# EAGLE design Guri_AVR.old (EAGLE 7.3.0)
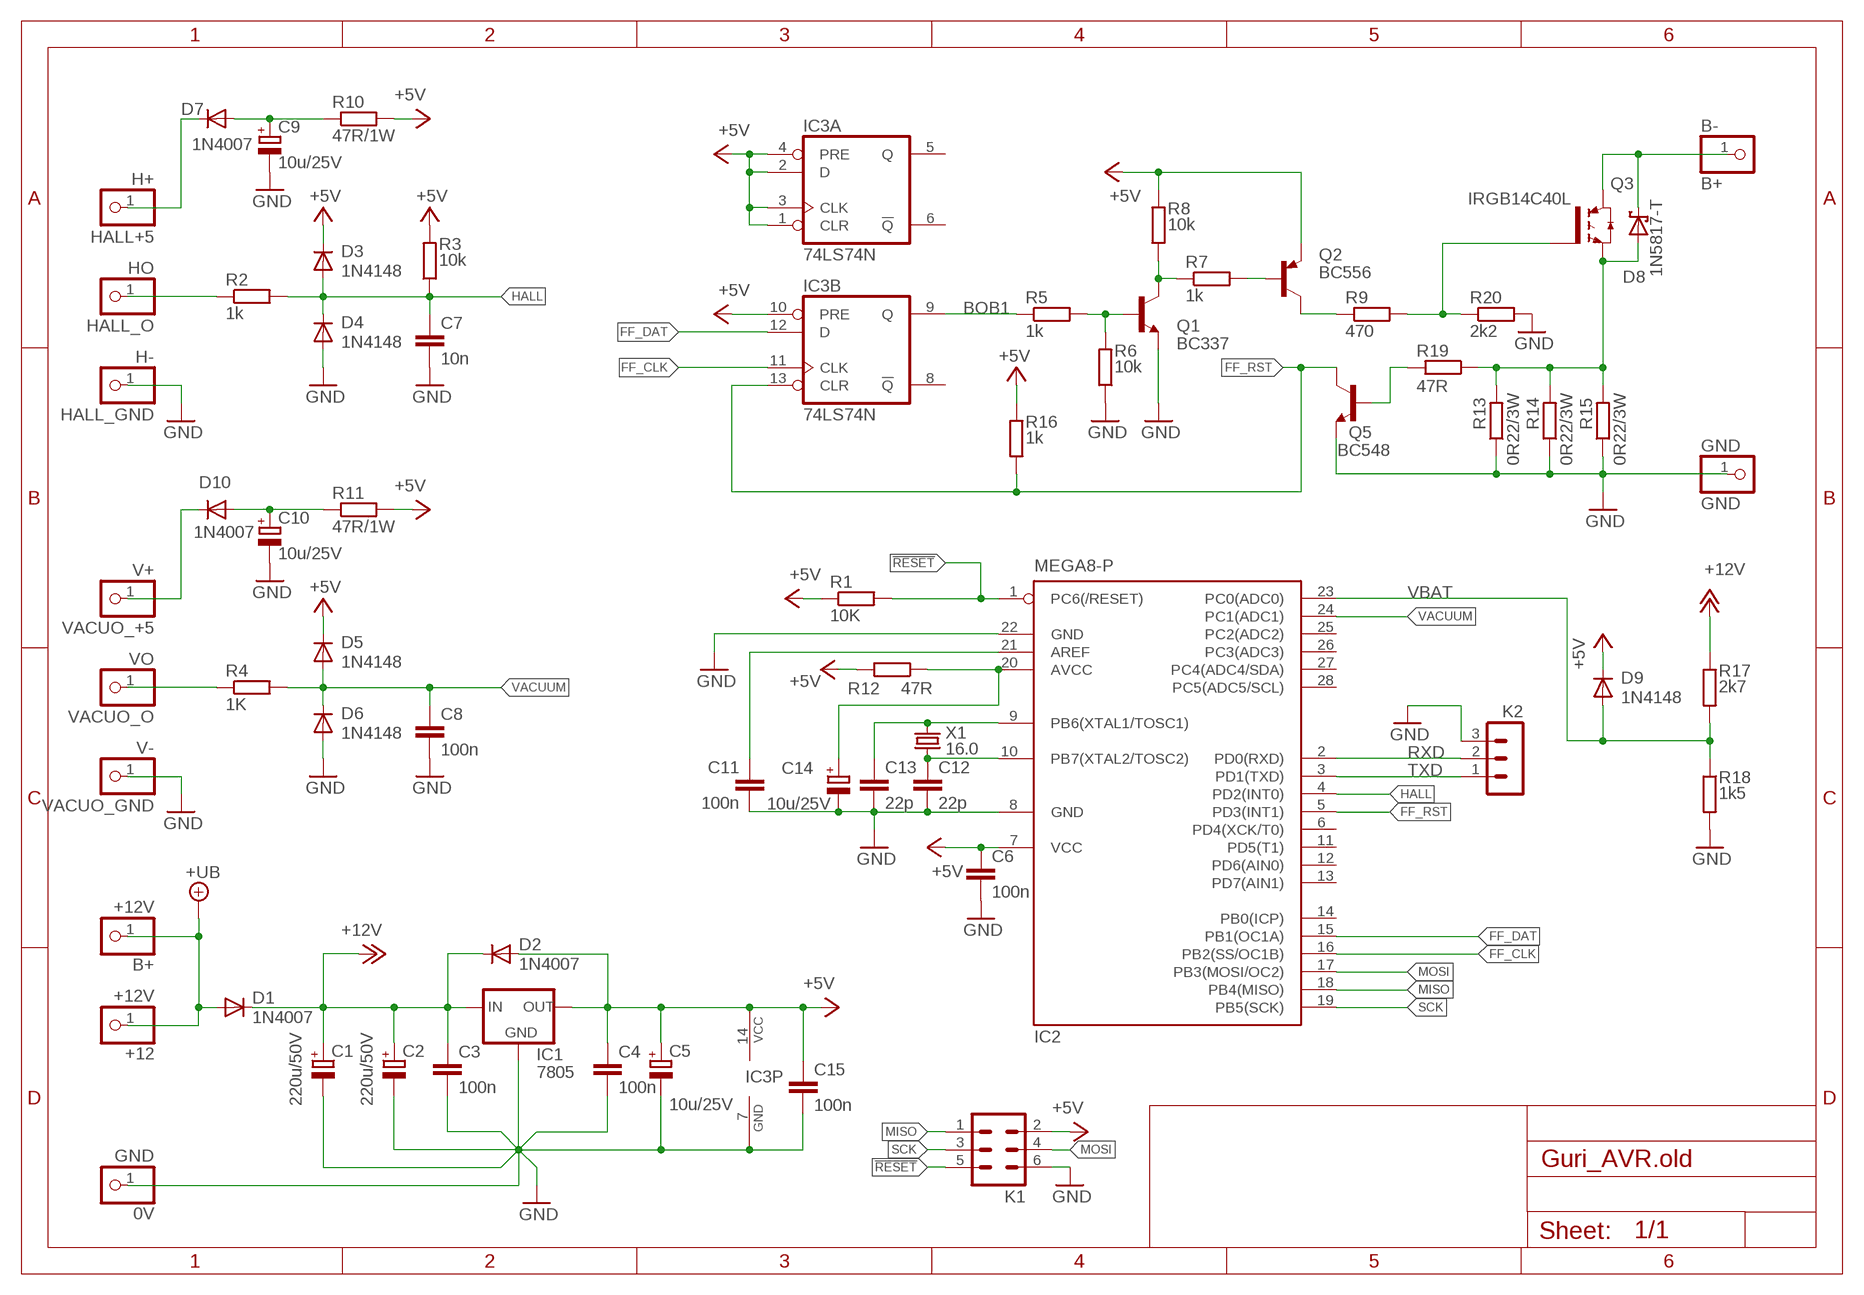
[diagram p0: schematic, sheet 1]

## Parts
0V  GND  PINHD-1X1  [1X01]
+12  +12V  PINHD-1X1  [1X01]
B+  +12V  PINHD-1X1  [1X01]
B-  B+  PINHD-1X1  [1X01]
C1  220u/50V  CPOL-EUE5-10.5  [E5-10,5]
C2  220u/50V  CPOL-EUE5-10.5  [E5-10,5]
C3  100n  C-EU050-025X075  [C050-025X075]
C4  100n  C-EU050-025X075  [C050-025X075]
C5  10u/25V  CPOL-EUE2-5  [E2-5]
C6  100n  C-EU050-025X075  [C050-025X075]
C7  10n  C-EU050-025X075  [C050-025X075]
C8  100n  C-EU050-025X075  [C050-025X075]
C9  10u/25V  CPOL-EUE2-5  [E2-5]
C10  10u/25V  CPOL-EUE2-5  [E2-5]
C11  100n  C-EU050-025X075  [C050-025X075]
C12  22p  C-EU050-024X044  [C050-024X044]
C13  22p  C-EU050-024X044  [C050-024X044]
C14  10u/25V  CPOL-EUE2-5  [E2-5]
C15  100n  C-EU050-025X075  [C050-025X075]
D1  1N4007  DIODE-D-7.5  [D-7.5]
D2  1N4007  DIODE-D-7.5  [D-7.5]
D3  1N4148  1N4148DO35-7  [DO35-7]
D4  1N4148  1N4148DO35-7  [DO35-7]
D5  1N4148  1N4148DO35-7  [DO35-7]
D6  1N4148  1N4148DO35-7  [DO35-7]
D7  1N4007  DIODE-D-7.5  [D-7.5]
D8  1N5817-T  [DO41-7.6]
D9  1N4148  1N4148DO35-7  [DO35-7]
D10  1N4007  DIODE-D-7.5  [D-7.5]
GND  GND  PINHD-1X1  [1X01]
H+  HALL+5  PINHD-1X1  [1X01]
H-  HALL_GND  PINHD-1X1  [1X01]
HO  HALL_O  PINHD-1X1  [1X01]
IC1  7805  78XXS  [78XXS]
IC2  MEGA8-P  [DIL28-3]
IC3  74LS74N  [DIL14]
K1  ML6  [ML6]
K2  MA03-1  [MA03-1]
Q1  BC337  BC338  [TO92-EBC]
Q2  BC556  [TO92-EBC]
Q3  IRGB14C40L  IRG4BC15UD--L  [TO262-V]
Q5  BC548  BC338  [TO92-EBC]
R1  10K  R-EU_0207/7L  [0207/7L]
R2  1k  R-EU_0207/7L  [0207/7L]
R3  10k  R-EU_0207/7L  [0207/7L]
R4  1K  R-EU_0207/7L  [0207/7L]
R5  1k  R-EU_0207/7L  [0207/7L]
R6  10k  R-EU_0207/7L  [0207/7L]
R7  1k  R-EU_0207/7L  [0207/7L]
R8  10k  R-EU_0207/7L  [0207/7L]
R9  470  R-EU_0207/7L  [0207/7L]
R10  47R/1W  R-EU_0207/7L  [0207/7L]
R11  47R/1W  R-EU_0207/7L  [0207/7L]
R12  47R  R-EU_0207/7L  [0207/7L]
R13  0R22/3W  R-EU_0309/10  [0309/10]
R14  0R22/3W  R-EU_0309/10  [0309/10]
R15  0R22/3W  R-EU_0309/10  [0309/10]
R16  1k  R-EU_0207/7L  [0207/7L]
R17  2k7  R-EU_0207/7L  [0207/7L]
R18  1k5  R-EU_0207/7L  [0207/7L]
R19  47R  R-EU_0207/7L  [0207/7L]
R20  2k2  R-EU_0207/7L  [0207/7L]
V+  VACUO_+5  PINHD-1X1  [1X01]
V-  VACUO_GND  PINHD-1X1  [1X01]
VO  VACUO_O  PINHD-1X1  [1X01]
X1  16.0  CRYSTALHC49S  [HC49/S]

## Nets
!RESET: IC2.1(PC6(/RESET)) K1.5 R1.4
+5V: C4.1 C5.+ C6.1 C15.1 D2.A D3.C D5.C D9.C IC1.OUT IC2.7(VCC) IC3.1(A:CLR) IC3.2(A:D) IC3.3(A:CLK) IC3.4(A:PRE) IC3.10(B:PRE) IC3.14(P:VCC) K1.2 Q2.E R1.3 R3.4 R8.4 R10.4 R11.4 R12.4 R16.4
+12V: C1.+ C2.+ C3.1 D1.C D2.C IC1.IN R17.3
+UB: +12.1 B+.1 D1.A
AREF: C11.1 IC2.21(AREF)
AVCC: C14.+ IC2.20(AVCC) R12.3
BOB1: IC3.9(B:Q) R5.3
FF_CLK: IC2.16(PB2(SS/OC1B)) IC3.11(B:CLK)
FF_DAT: IC2.15(PB1(OC1A)) IC3.12(B:D)
FF_RST: IC2.5(PD3(INT1)) IC3.13(B:CLR) Q5.C R16.3
GND: 0V.1 C1.- C2.- C3.2 C4.2 C5.- C6.2 C7.2 C8.2 C9.- C10.- C11.2 C12.2 C13.2 C14.- C15.2 D4.A D6.A GND.1 H-.1 IC1.GND IC2.8(GND) IC2.22(GND) IC3.7(P:GND) K1.6 K2.3 Q1.E Q5.E R6.3 R13.1 R14.1 R15.1 R18.4 R20.4 V-.1
HALL: C7.1 D3.A D4.C IC2.4(PD2(INT0)) R2.4 R3.3
HALL_IN: HO.1 R2.3
MISO: IC2.18(PB4(MISO)) K1.1
MOSI: IC2.17(PB3(MOSI/OC2)) K1.4
N$1: C9.+ D7.A R10.3
N$2: D10.C V+.1
N$3: Q2.B R7.4
N$4: Q1.C R7.3 R8.3
N$5: Q1.B R5.4 R6.4
N$6: C10.+ D10.A R11.3
N$7: D7.C H+.1
N$8: Q2.C R9.3
N$9: Q3.1(G) R9.4 R20.3
N$10: B-.1 D8.C Q3.2(C)
N$11: C13.1 IC2.9(PB6(XTAL1/TOSC1)) X1.2
N$12: C12.1 IC2.10(PB7(XTAL2/TOSC2)) X1.1
N$13: Q5.B R19.4
N$19: D8.A Q3.3(E) R13.2 R14.2 R15.2 R19.3
RXD: IC2.2(PD0(RXD)) K2.2
SCK: IC2.19(PB5(SCK)) K1.3
TXD: IC2.3(PD1(TXD)) K2.1
VAC-IN: R4.3 VO.1
VACUUM: C8.1 D5.A D6.C IC2.24(PC1(ADC1)) R4.4
VBAT: D9.A IC2.23(PC0(ADC0)) R17.4 R18.3
Unconnected: IC2.6(PD4(XCK/T0)) IC2.11(PD5(T1)) IC2.12(PD6(AIN0)) IC2.13(PD7(AIN1)) IC2.14(PB0(ICP)) IC2.25(PC2(ADC2)) IC2.26(PC3(ADC3)) IC2.27(PC4(ADC4/SDA)) IC2.28(PC5(ADC5/SCL)) IC3.5(A:Q) IC3.6(A:!Q) IC3.8(B:!Q)

## Library data of the parts
0V +12 B+ B- GND H+ H- HO V+ V- VO = pinhead:PINHD-1X1: PIN HEADER
C1 C2 C5 C9 C10 C14 = rcl:CPOL-EU: POLARIZED CAPACITOR, European symbol
C3 C4 C6-C8 C11-C13 C15 = rcl:C-EU: CAPACITOR, European symbol
D1 D2 D7 D10 = diode:DIODE-: DIODE
D3-D6 D9 = diode:1N4148: DIODE high speed (Philips)
D8 = diode:1N581*: 1.0A SCHOTTKY BARRIER RECTIFIER Source: http://www.diodes.com/datasheets/ds23001.pdf
IC1 = v-reg:78XXS: VOLTAGE REGULATOR
IC2 = atmel:MEGA8-P: MICROCONTROLLER 8 Kbytes FLASH, 1 kbytes SRAM, 512 bytes EEPROM, USART, 4-channel 10 bit ADC, 2-channel 8 bit ADC Pin compatible with Atmega48, ATMega88, ATMega168 Source: avr.lbr; OC_FARNELL: unknown; OC_NEWARK: unknown
IC3 = 74xx-us:74*74: Dual D type positive edge triggered FLIP FLOP, preset and clear
K1 = con-ml:ML6: HARTING; OC_FARNELL: unknown; OC_NEWARK: unknown
K2 = con-lstb:MA03-1: PIN HEADER; OC_FARNELL: unknown; OC_NEWARK: unknown
Q1 Q5 = transistor-npn:BC338*: NPN Transistor
Q2 = transistor-pnp:BC556*: PNP Transistror
Q3 = transistor-power:IRG4BC15UD-: INSULATED GATE BIPOLAR TRANSISTOR WITH ULTRAFAST SOFT RECOVERY DIODE
R1-R20 = rcl:R-EU_: RESISTOR, European symbol
X1 = crystal:CRYSTAL: CRYSTAL; OC_FARNELL: 1667008; OC_NEWARK: unknown

## Board
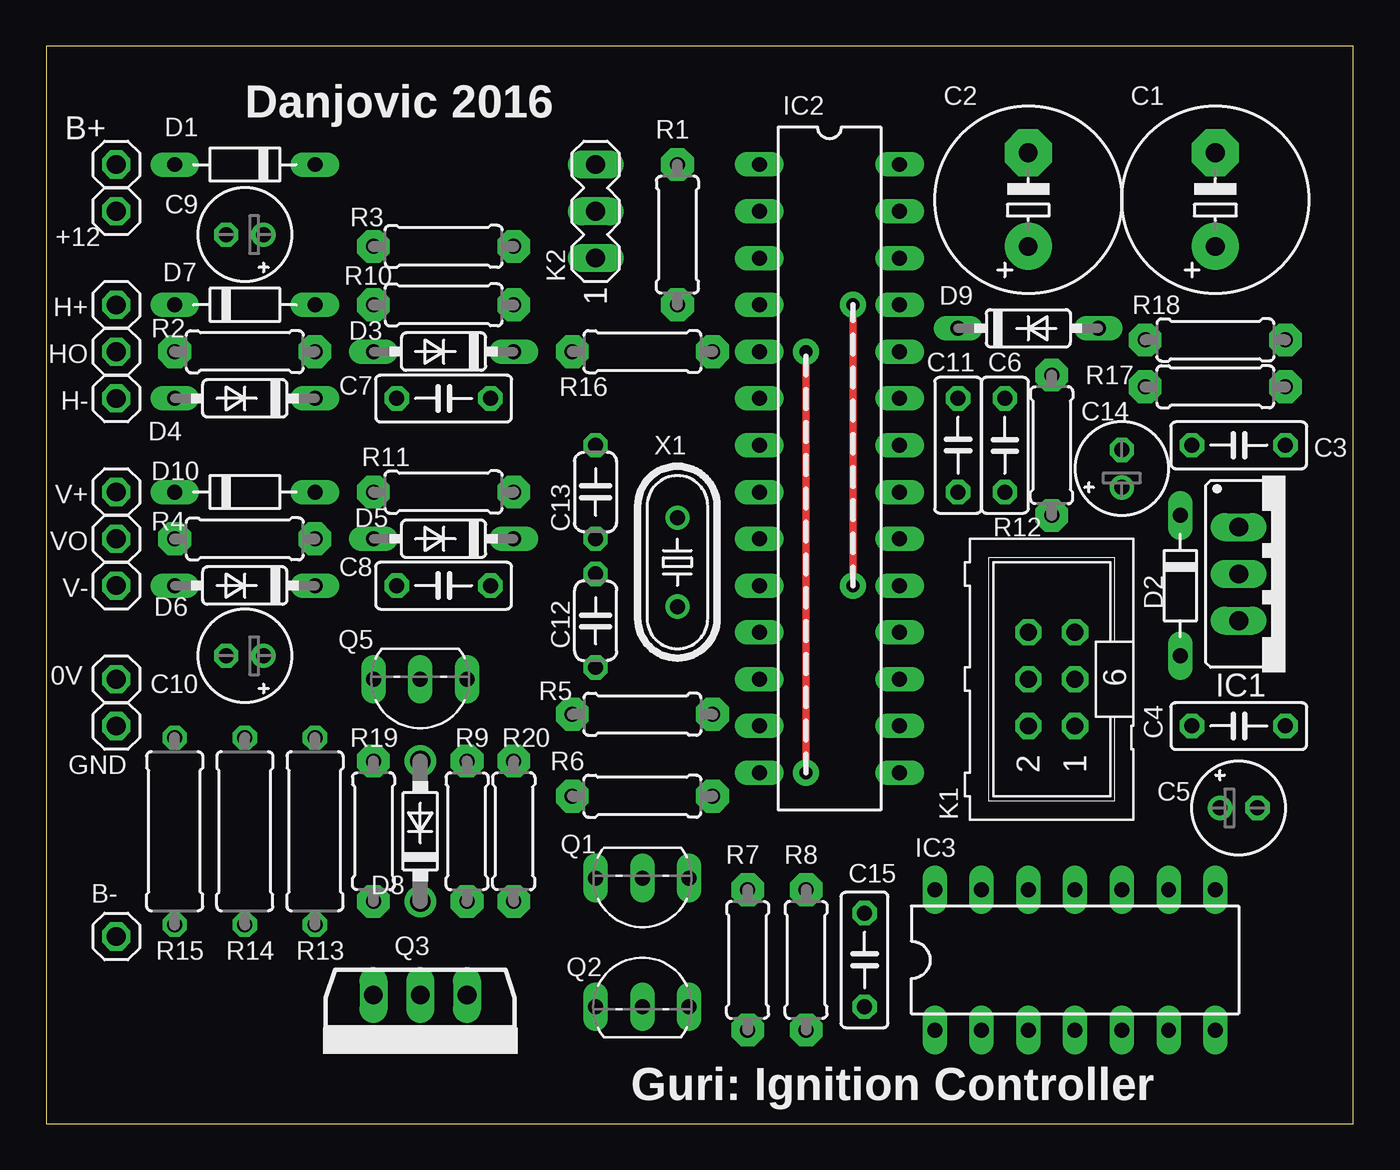
[diagram p1: board, top side]
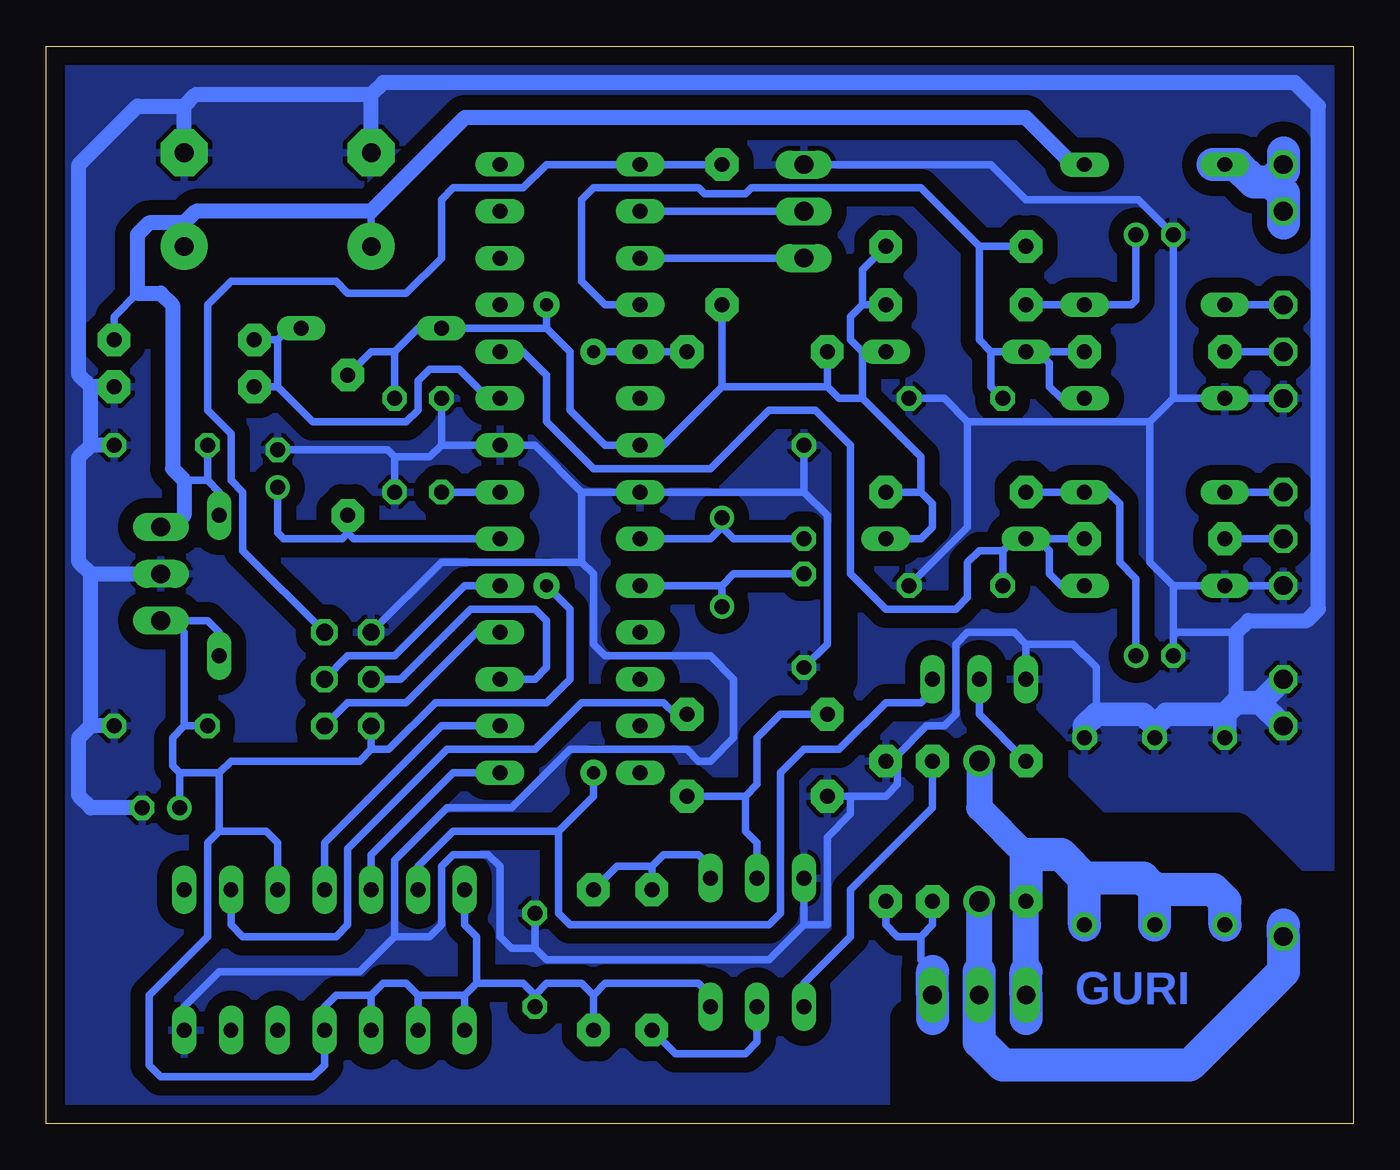
[diagram p2: board, bottom side, seen from below]

Size 71 x 58.5 mm. Coordinates in mm from the lower left corner, seen from the top.
Outline: 0,0 71,0 71,58.5 0,58.5 0,0
Copper layers (1*16): Top 0.035mm / dielectric 1.5mm / Bottom 0.035mm
Design rules "default *": minimum track width 10mil, minimum drill 24mil, track to track 8mil, track to pad 8mil, pad to pad 8mil, via to via 8mil, smd to smd 8mil, copper to edge 40mil, drill to drill 8mil, minimum pad ring 10mil, minimum via ring 8mil, stop-mask expansion 4mil, vias tented up to drill 0mil, thermal gap 10mil
bRestrict: 8 lines

### Footprints (pad centres in the part's own frame; a part is rotated, then mirrored left to right if it is on the bottom)
1X01 = drill 1.016 octagon: 1 0,0
E5-10,5 = drill 1.016 pad 2.54: + -2.54,0 | drill 1.016 pad 2.54 octagon: - 2.54,0
C050-025X075 = drill 0.813 octagon: 1 -2.54,0; 2 2.54,0
E2-5 = drill 0.813 pad 1.27: + -1.016,0 | drill 0.813 pad 1.27 octagon: - 1.016,0
C050-024X044 = drill 0.813 octagon: 1 -2.54,0; 2 2.54,0
D-7.5 = drill 0.813 long: A 3.81,0; C -3.81,0
DO35-7 = drill 0.813 long: A 3.81,0; C -3.81,0
DO41-7.6 = drill 1.1 pad 1.7: A 3.81,0; C -3.81,0
78XXS = drill 1.016 long: GND 0,-2.54; IN -2.54,-2.54; OUT 2.54,-2.54
DIL28-3 = drill 0.813 long: 1 -16.51,-3.81; 2 -13.97,-3.81; 3 -11.43,-3.81; 4 -8.89,-3.81; 5 -6.35,-3.81; 6 -3.81,-3.81; 7 -1.27,-3.81; 8 1.27,-3.81; 9 3.81,-3.81; 10 6.35,-3.81; 11 8.89,-3.81; 12 11.43,-3.81; 13 13.97,-3.81; 14 16.51,-3.81; 15 16.51,3.81; 16 13.97,3.81; 17 11.43,3.81; 18 8.89,3.81; 19 6.35,3.81; 20 3.81,3.81; 21 1.27,3.81; 22 -1.27,3.81; 23 -3.81,3.81; 24 -6.35,3.81; 25 -8.89,3.81; 26 -11.43,3.81; 27 -13.97,3.81; 28 -16.51,3.81
DIL14 = drill 0.813 long: 1 -7.62,-3.81; 2 -5.08,-3.81; 3 -2.54,-3.81; 4 0,-3.81; 5 2.54,-3.81; 6 5.08,-3.81; 7 7.62,-3.81; 8 7.62,3.81; 9 5.08,3.81; 10 2.54,3.81; 11 0,3.81; 12 -2.54,3.81; 13 -5.08,3.81; 14 -7.62,3.81
ML6 = drill 0.914 octagon: 1 -2.54,-1.27; 2 -2.54,1.27; 3 0,-1.27; 4 0,1.27; 5 2.54,-1.27; 6 2.54,1.27
MA03-1 = drill 1.016 long: 1 -2.54,0; 2 0,0; 3 2.54,0
TO92-EBC = drill 0.813 long: B 0,-1.27; C -2.54,-1.27; E 2.54,-1.27
TO262-V = drill 1.016 long: 1 -2.54,0; 2 0,0; 3 2.54,0
0207/7L = drill 0.813 pad 1.778 octagon: 3 -3.81,0; 4 3.81,0
0309/10 = drill 0.813 octagon: 1 -5.08,0; 2 5.08,0
HC49/S = drill 0.813: 1 -2.413,0; 2 2.413,0

### Placement (x,y rotation side)
0V  3.81,24.13 0 top
+12  3.81,49.53 0 top
B+  3.81,52.07 0 top
B-  3.81,10.16 0 top
C1  63.5,50.16 90 top
C2  53.34,50.16 90 top
C3  64.77,36.83 0 top
C4  64.77,21.59 0 top
C5  64.77,17.14 0 top
C6  52.07,36.83 270 top
C7  21.59,39.37 0 top
C8  21.59,29.21 0 top
C9  10.79,48.26 180 top
C10  10.79,25.4 180 top
C11  49.53,36.83 90 top
C12  29.84,27.3 270 top
C13  29.84,34.29 90 top
C14  58.42,35.56 90 top
C15  44.45,8.89 90 top
D1  10.79,52.07 180 top
D2  61.59,29.21 270 top
D3  21.59,41.91 180 top
D4  10.79,39.37 180 top
D5  21.59,31.75 180 top
D6  10.79,29.21 180 top
D7  10.79,44.45 0 top
D8  20.32,15.88 90 top
D9  53.34,43.18 0 top
D10  10.79,34.29 0 top
GND  3.81,21.59 0 top
H+  3.81,44.45 0 top
H-  3.81,39.37 0 top
HO  3.81,41.91 0 top
IC1  67.31,29.84 270 top
IC2  42.55,35.56 270 top
IC3  55.88,8.89 0 top
K1  54.61,24.13 90 top
K2  29.84,49.53 90 top
Q1  32.38,12.06 180 top
Q2  32.38,7.62 0 top
Q3  20.32,6.99 180 top
Q5  20.32,22.86 180 top
R1  34.29,48.26 90 top
R2  10.79,41.91 0 top
R3  21.59,47.62 0 top
R4  10.79,31.75 0 top
R5  32.38,22.23 180 top
R6  32.38,17.78 0 top
R7  38.1,8.89 270 top
R8  41.27,8.89 270 top
R9  22.86,15.88 270 top
R10  21.59,44.45 0 top
R11  21.59,34.29 0 top
R12  54.61,36.83 90 top
R13  14.61,15.88 270 top
R14  10.79,15.88 270 top
R15  6.99,15.88 270 top
R16  32.38,41.91 180 top
R17  63.5,42.55 180 top
R18  63.5,40.01 0 top
R19  17.78,15.88 90 top
R20  25.4,15.88 90 top
V+  3.81,34.29 0 top
V-  3.81,29.21 0 top
VO  3.81,31.75 0 top
X1  34.29,30.48 90 top

### Tracks (layer width: path | path; a pad name or v marks a point on that pad's centre or on a via)
!RESET
  Bottom 0.406: R1.4 IC2.1 43.81,52.07 45.09,50.8 48.9,50.8 49.53,50.16 49.53,46.99 51.44,45.09 54.61,45.09 55.24,45.72 60.96,45.72 62.23,44.45 62.23,38.73 60.96,37.47 60.96,34.92 60.33,34.29 60.33,31.11 K1.5
+5V  (via drill 0.7 pad 1.42)
  Top 0.406: v43.81,29.21 v43.81,44.45
  Bottom 0.406: 26.04,31.75 D5.C 23.5,31.75 22.86,32.38 22.86,33.66 23.5,34.29 | R1.3 34.29,40.01 | 48.26,6.99 50.8,6.99 | IC3.2 50.8,6.99 | 50.8,6.99 51.44,7.62 52.7,7.62 53.34,6.99 | IC3.3 53.34,6.99 | 53.34,6.99 55.24,6.99 55.88,6.35 IC3.4 55.88,3.17 56.52,2.54 64.77,2.54 65.41,3.17 65.41,6.99 62.23,10.16 62.23,15.24 61.59,15.88 | R8.4 41.27,6.99 | 41.27,6.99 41.91,7.62 43.81,7.62 44.45,6.99 | C15.1 44.45,6.99 | 44.45,6.99 45.09,7.62 47.62,7.62 | 47.62,7.62 48.26,6.99 | 48.26,6.99 IC3.1 | 52.07,41.91 C6.1 | IC3.14 48.26,10.79 47.62,10.16 47.62,7.62 | 61.59,15.88 61.59,19.05 | K1.2 53.34,20.32 | 53.34,20.32 53.98,19.68 60.96,19.68 61.59,19.05 | 63.5,21.59 64.14,20.95 64.14,19.43 63.75,19.05 | 63.5,21.59 C4.1 | 63.5,21.59 63.5,26.67 64.14,27.3 IC1.OUT 62.23,27.3 61.59,26.67 D2.A | 34.29,40.01 37.47,36.83 IC2.7 40.64,36.83 42.55,38.73 42.55,41.91 43.81,43.18 | R3.4 26.67,46.35 26.67,44.45 | R10.4 26.67,44.45 | 23.5,34.29 23.5,36.2 26.67,39.37 | 23.5,34.29 R11.4 | D3.C 26.67,41.91 | 26.67,41.91 27.3,42.55 27.3,43.81 26.67,44.45 | 26.67,39.37 26.67,41.91 | 26.67,39.37 27.94,39.37 28.57,40.01 | 28.57,40.01 34.29,40.01 | R16.4 28.57,40.01 | Q2.E 34.92,6.99 35.56,7.62 40.64,7.62 41.27,6.99 | 53.34,20.32 52.39,20.32 49.85,22.86 43.81,22.86 42.55,24.13 42.55,27.94 v43.81,29.21 | v43.81,44.45 43.81,43.18 | IC3.10 58.42,15.24 59.05,15.88 61.59,15.88 | 61.59,19.05 63.75,19.05 | 63.75,19.05 C5.+ | R12.4 53.34,41.91 52.07,41.91 | 52.07,41.91 50.8,43.18 D9.C 43.81,43.18
+12V
  Bottom 0.406: 53.34,49.53 C2.+ | R17.3 67.31,43.81 66.04,45.09 | 63.5,48.9 C1.+ | D2.C 61.59,34.29 62.23,34.92 | 62.23,34.92 C3.1 | 62.23,34.92 63.5,34.92
  Bottom 0.813: D1.C 15.24,52.07 17.78,54.61 48.26,54.61 53.34,49.53 62.87,49.53 63.5,48.9 65.41,48.9 66.04,48.26 66.04,45.09 64.77,45.09 64.14,44.45 64.14,35.56 63.5,34.92 63.5,33.02 64.14,32.38 IC1.IN
+UB
  Bottom 1.778: 3.81,48.9 +12.1 3.81,50.48 4.45,51.12 | 3.81,52.7 B+.1 3.81,51.75 4.45,51.12 | 7.62,52.07 D1.A 6.35,52.07 5.4,51.12 4.45,51.12
AREF
  Bottom 0.406: IC2.21 C11.1
AVCC
  Bottom 0.406: R12.3 54.61,32.07 | 54.61,32.07 54.29,31.75 IC2.20 | C14.+ 58.42,32.07 58.1,31.75 54.93,31.75 54.61,32.07
BOB1
  Bottom 0.406: R5.3 36.83,22.23 37.47,22.86 41.91,22.86 44.45,20.32 49.21,20.32 54.61,14.92 54.61,10.79 55.24,10.16 60.33,10.16 60.96,10.79 IC3.9
FF_CLK
  Bottom 0.406: IC2.16 49.53,21.59 55.88,15.24 IC3.11
FF_DAT
  Bottom 0.406: IC2.15 48.9,19.05 53.34,14.61 IC3.12
FF_RST  (via drill 0.7 pad 1.42)
  Top 0.406: v41.27,41.91 v41.27,19.05
  Bottom 0.406: 43.18,15.88 48.9,15.88 50.8,13.97 IC3.13 | Q5.C 22.86,23.5 23.5,22.86 25.4,22.86 27.94,20.32 29.84,20.32 31.11,19.05 31.11,11.43 31.75,10.79 42.55,10.79 43.18,11.43 43.18,15.88 | v41.27,41.91 IC2.5 R16.3 | v41.27,19.05 41.27,17.78 43.18,15.88
GND
  Bottom 0.406: H-.1 D4.A 9.78,39.37 | V-.1 D6.A 9.78,29.21 | 9.78,29.21 C10.- 9.78,26.42 arc90 9.53,26.67 6.35,26.67 | 9.78,39.37 C9.- 11.68,50.16 17.78,50.16 19.68,52.07 K2.3 | 9.78,29.21 11.05,30.48 11.05,38.1 | C7.2 22.23,39.37 20.95,38.1 | C12.2 28.57,26.04 28.57,33.02 29.84,34.29 | 29.84,34.29 IC2.8 41.91,34.29 | C13.2 29.84,34.29 | 41.91,34.29 44.45,36.83 IC2.22 49.53,36.83 | C11.2 49.53,36.83 | IC3.7 63.5,6.35 61.59,8.26 53.98,8.26 52.07,10.16 | C15.2 44.45,9.53 | 44.45,9.53 43.81,8.89 31.75,8.89 29.84,10.79 | 29.84,10.79 Q1.E | 44.45,9.53 45.72,9.53 46.35,10.16 46.35,13.97 46.99,14.61 48.9,14.61 49.53,13.97 49.53,10.79 50.16,10.16 52.07,10.16 | K1.6 49.53,30.48 41.91,30.48 | 41.91,30.48 41.91,34.29 | 41.91,30.48 41.27,29.84 41.27,26.04 40.64,25.4 34.92,25.4 33.66,24.13 33.66,20.95 34.92,19.68 35.56,19.68 36.2,20.32 42.55,20.32 45.72,17.14 49.21,17.14 52.07,14.29 52.07,10.16 | 49.53,36.83 50.16,36.2 52.07,36.2 | C6.2 52.07,36.2 | 27.3,17.78 25.4,17.78 24.77,18.41 24.77,20 23.18,21.59 22.23,21.59 21.59,22.23 21.59,26.04 20.95,26.67 18.41,26.67 17.78,26.04 | 27.3,17.78 27.3,16.83 28.57,15.56 28.57,10.79 29.84,10.79 | 27.3,17.78 R6.3 | 11.05,38.1 20.95,38.1 | 9.78,39.37 11.05,38.1 | Q5.E 17.78,26.04 | 17.78,26.04 15.24,26.04 13.97,24.77 13.97,22.23 | 20.95,38.1 20.95,32.38 C8.2 | C14.- 52.45,36.58 52.07,36.2
  Bottom 0.813: 6.35,22.86 6.35,26.67 5.71,27.3 2.54,27.3 1.91,27.94 1.91,55.24 3.17,56.52 52.7,56.52 53.34,55.88 | 68.58,29.84 IC1.GND | C2.- 53.34,55.88 | C1.- 63.5,55.24 | 63.5,55.24 62.87,55.88 53.34,55.88 | 68.58,29.84 69.22,30.48 69.22,36.2 68.58,36.83 | 68.58,36.83 68.58,40.01 | 68.58,40.01 69.22,40.64 69.22,52.07 66.04,55.24 63.5,55.24 | R18.4 68.58,40.01 | C3.2 68.58,36.83 | C5.- 68.58,17.14 69.22,17.78 69.22,20.95 68.58,21.59 | 68.58,21.59 68.58,29.84 | C4.2 68.58,21.59
  Bottom 1.27: GND.1 5.08,22.86 | 5.08,22.86 6.35,22.86 6.99,22.23 | 6.99,22.23 10.16,22.23 10.79,21.59 | 10.79,21.59 11.43,22.23 13.97,22.23 14.61,21.59 R13.1 | R14.1 10.79,21.59 | R15.1 6.99,22.23 | 0V.1 5.08,22.86
  pour Bottom (isolate 0.813): 0,0 70.97,0 70.97,58.59 0,58.59
HALL
  Bottom 0.406: R2.4 D3.A | R3.3 20.32,47.62 | D4.C 15.88,39.37 16.51,40.01 16.51,41.27 17.14,41.91 D3.A | 20.32,47.62 20.32,42.55 19.68,41.91 | 19.68,41.91 19.68,40.01 C7.1 | D3.A 19.68,41.91 | IC2.4 40.64,44.45 41.91,45.72 41.91,50.16 41.27,50.8 35.56,50.8 35.24,50.48 33.02,50.48 32.7,50.8 23.5,50.8 20.32,47.62
HALL_IN
  Bottom 0.406: HO.1 R2.3
MISO
  Bottom 0.406: K1.1 54.61,22.86 51.44,22.86 47.62,26.67 IC2.18
MOSI
  Bottom 0.406: K1.4 51.75,24.13 47.94,27.94 44.45,27.94 43.81,27.3 43.81,24.77 44.45,24.13 IC2.17
N$1
  Bottom 0.406: R10.3 D7.A 12.06,44.45 11.81,44.7 C9.+
N$2
  Bottom 0.406: V+.1 D10.C
N$3
  Bottom 0.406: Q2.B 32.38,4.45 33.02,3.81 36.83,3.81 R7.4
N$4
  Bottom 0.406: Q1.C 34.92,13.97 35.56,14.61 37.47,14.61 38.1,13.97 | 38.1,13.97 40.01,13.97 R8.3 | R7.3 38.1,13.97
N$5
  Bottom 0.406: R5.4 31.11,22.23 32.38,20.95 32.38,18.41 33.02,17.78 | 33.02,17.78 33.02,15.88 32.38,15.24 Q1.B | R6.4 33.02,17.78
N$6
  Bottom 0.406: C10.+ 11.81,29.59 12.7,30.48 12.7,33.66 13.34,34.29 D10.A R11.3
N$7
  Bottom 0.406: H+.1 D7.C
N$8
  Bottom 0.406: R9.3 22.86,17.14 27.3,12.7 27.3,10.16 29.84,7.62 Q2.C
N$9
  Bottom 0.406: R9.4 22.86,10.79 23.5,10.16 | 23.5,10.16 23.5,8.89 22.86,8.26 | R20.3 25.4,10.79 24.77,10.16 23.5,10.16
  Bottom 1.778: 22.86,8.26 Q3.1 22.86,5.71
N$10
  Bottom 1.422: 20.32,8.26 D8.C
  Bottom 1.778: 3.81,10.79 B-.1 3.81,8.26 8.89,3.17 19.05,3.17 20.32,4.45 Q3.2 20.32,8.26
N$11
  Bottom 0.406: IC2.9 34.92,31.75 34.29,32.38 | 34.29,32.38 33.66,31.75 C13.1 | X1.2 34.29,32.38
N$12
  Bottom 0.406: IC2.10 34.29,29.21 | 34.29,29.21 33.66,29.84 C12.1 | 34.29,29.21 X1.1
N$13
  Bottom 0.406: R19.4 20.32,22.23 Q5.B
N$19
  Bottom 1.422: D8.A 20.32,17.14 17.78,14.61 | 17.78,8.26 R19.3
  Bottom 1.778: R19.3 17.78,14.61 15.88,14.61 14.61,13.34 | R15.2 6.99,12.06 7.62,12.7 10.79,12.7 | 10.79,12.7 11.43,13.34 14.61,13.34 | R13.2 14.61,13.34 | R14.2 10.79,12.7 | 17.78,5.71 Q3.3 17.78,8.26
RXD
  Bottom 0.406: K2.2 IC2.2
SCK
  Bottom 0.406: K1.3 54.61,25.4 52.07,25.4 48.26,29.21 IC2.19
TXD
  Bottom 0.406: IC2.3 K2.1
VAC-IN
  Bottom 0.406: VO.1 R4.3
VACUUM
  Bottom 0.406: IC2.24 45.09,41.91 43.81,40.64 43.81,38.1 41.27,35.56 34.92,35.56 31.75,38.73 29.21,38.73 27.3,36.83 27.3,29.84 25.4,27.94 21.59,27.94 20.95,28.57 20.95,30.48 20.32,31.11 19.05,31.11 | C8.1 19.05,31.11 | 19.05,31.11 18.41,31.75 D5.A 17.14,31.75 | 17.14,31.75 R4.4 | D6.C 15.88,29.21 16.51,29.84 16.51,31.11 17.14,31.75
VBAT
  Bottom 0.406: IC2.23 46.99,39.37 48.58,40.96 50.16,40.96 50.8,40.32 50.8,38.73 51.44,38.1 56.52,38.1 58.42,40.01 | 58.42,40.01 58.42,42.55 | 58.42,42.55 R17.4 | R18.3 58.42,40.01 | D9.A 57.78,43.18 58.42,42.55

### Text on the board
Bottom: GURI
tPlace: Danjovic 2016 | Guri: Ignition Controller